# Altium project Freezer_Controller.PrjPcb (part 1 of 2)
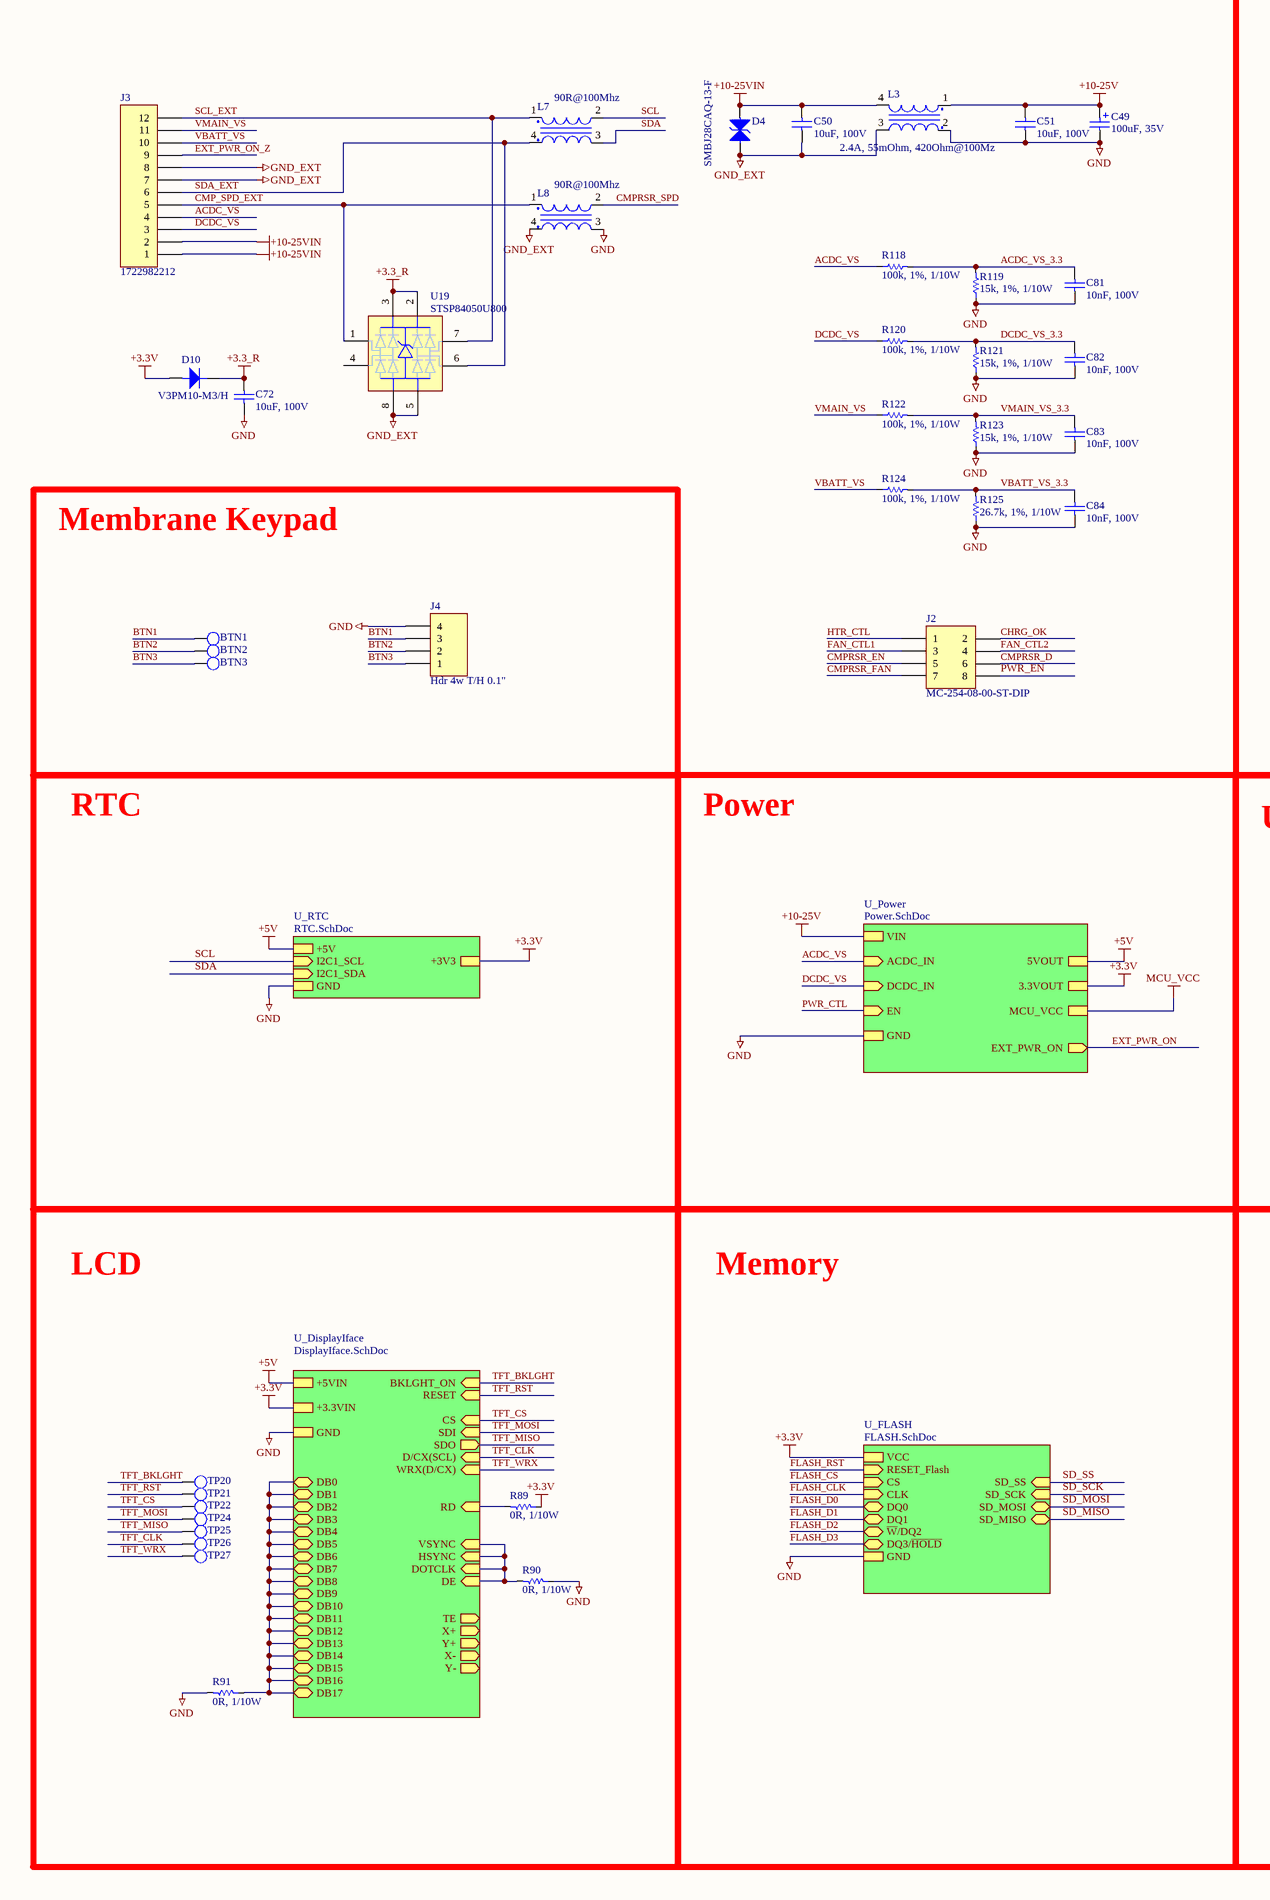
[diagram p0: TopLevel.SchDoc, left]
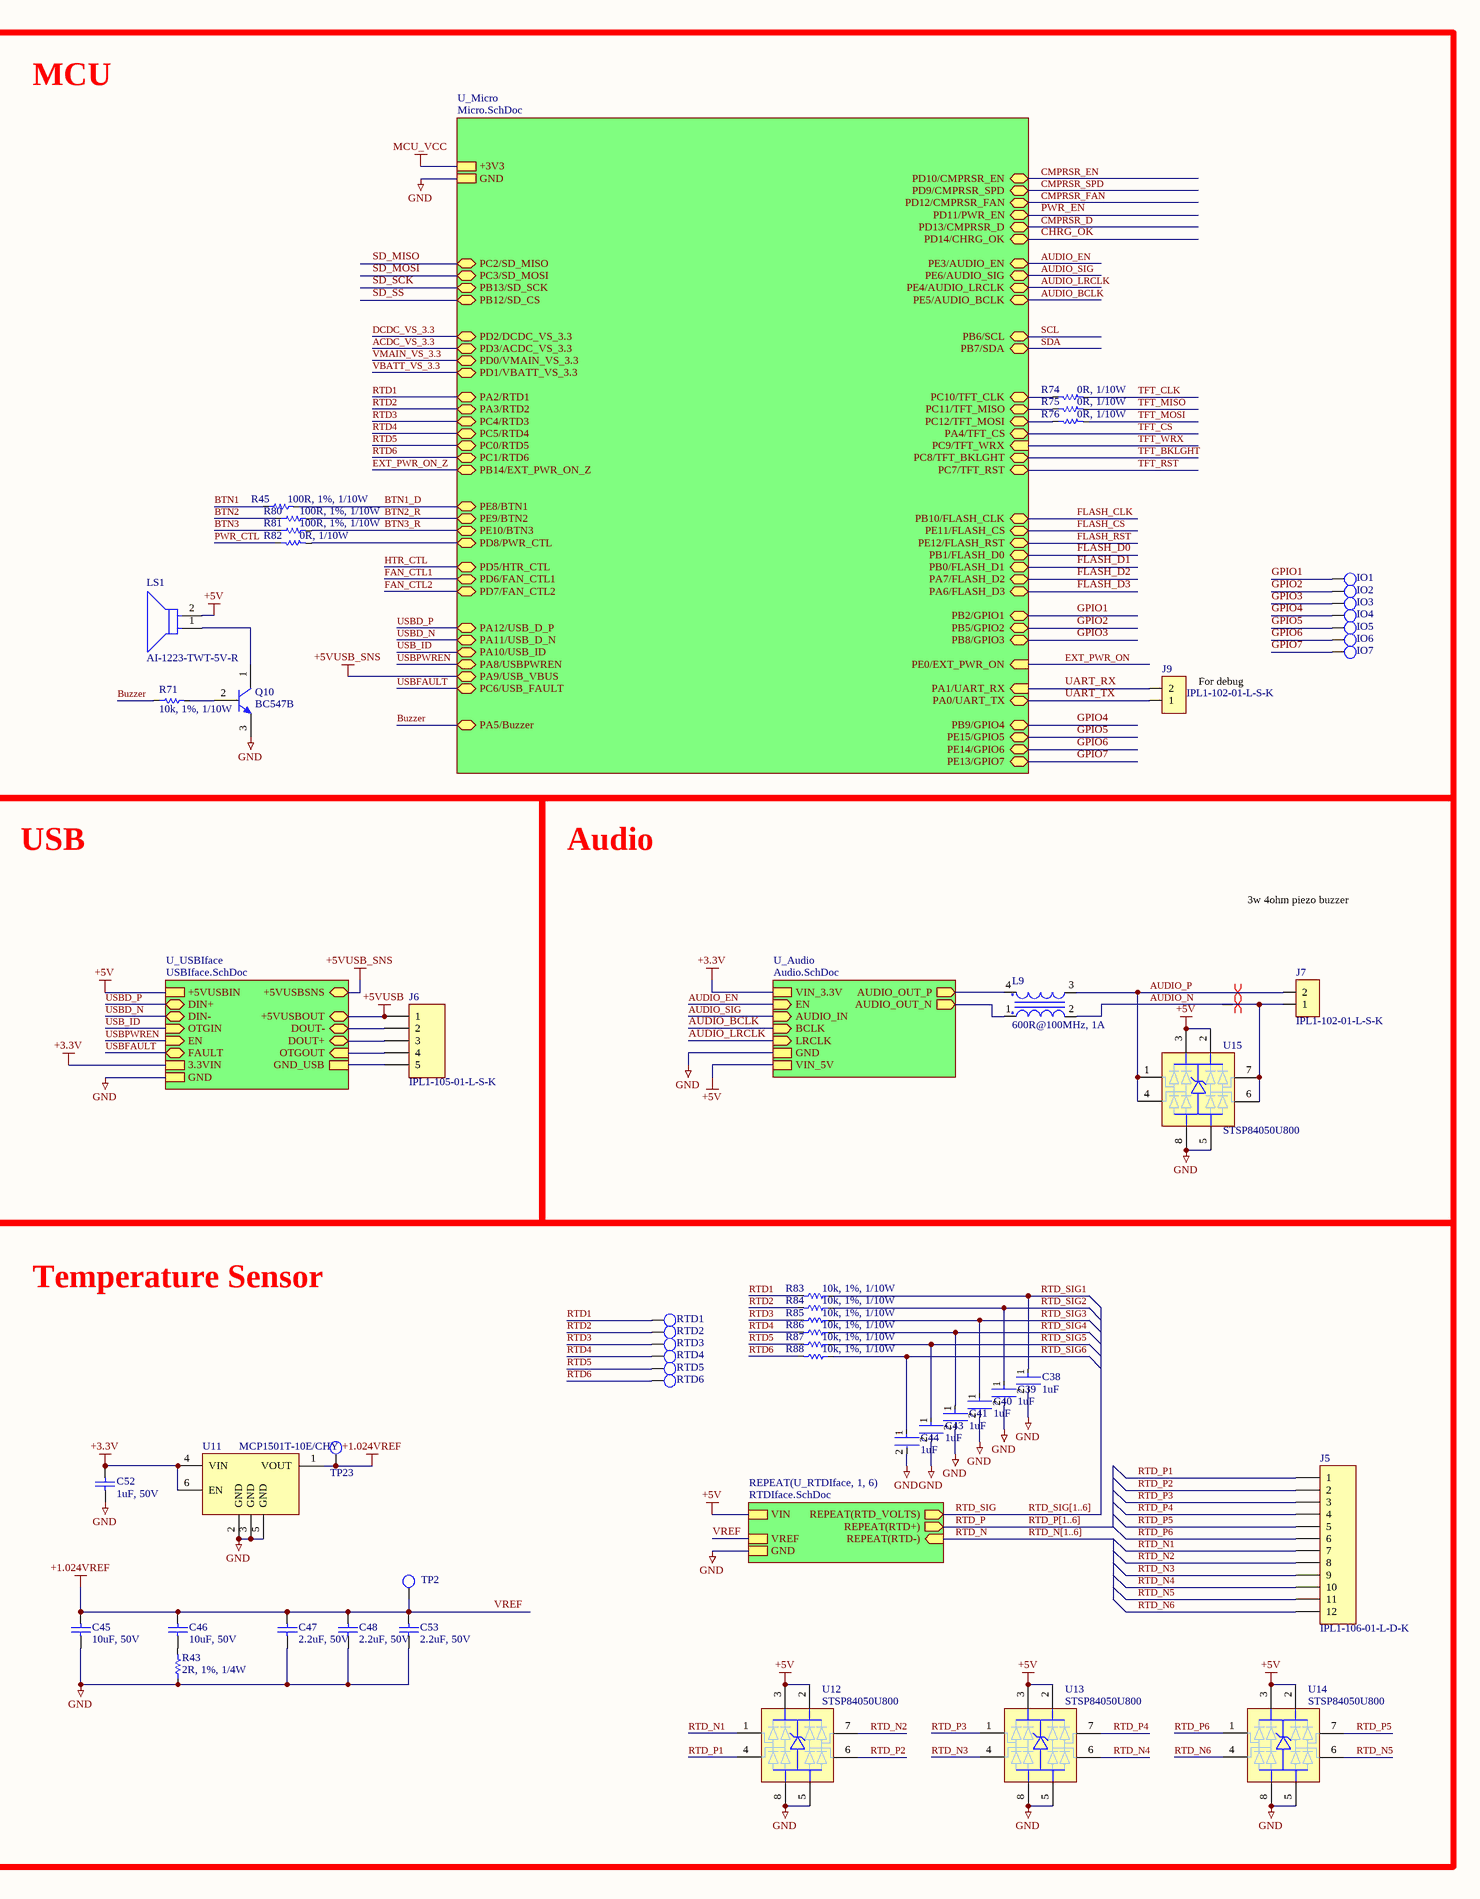
[diagram p1: TopLevel.SchDoc, right]
BOMRevision: 1.0; ProjectNumber: BIOL-003; ProjectRevision: 1.0; ProjectTitle: Freezer_Controller
9 sheets, 351 parts. Net scope: hierarchical (ports join the sheet entries above them; power ports are global).
Board file: Freezer_Controller.PcbDoc
Sheets:
  TopLevel.SchDoc
    U_Micro = Micro.SchDoc
    U_Power = Power.SchDoc
    U_RTDIface1 = RTDIface.SchDoc
    U_RTDIface2 = RTDIface.SchDoc
    U_RTDIface3 = RTDIface.SchDoc
    U_RTDIface4 = RTDIface.SchDoc
    U_RTDIface5 = RTDIface.SchDoc
    U_RTDIface6 = RTDIface.SchDoc
    U_DisplayIface = DisplayIface.SchDoc
    U_USBIface = USBIface.SchDoc
    U_Audio = Audio.SchDoc
    U_FLASH = FLASH.SchDoc
    U_RTC = RTC.SchDoc

## Sheet TopLevel.SchDoc
size A2; SheetNumber: 1; SheetTotal: 9

### Parts
BTN1  2mm  [TEST POINT 40 Mil]  (value not drawn)  (no BOM)
BTN2  2mm  [TEST POINT 40 Mil]  (value not drawn)  (no BOM)
BTN3  2mm  [TEST POINT 40 Mil]  (value not drawn)  (no BOM)
C38  1uF  [FP-CL10B105KO8NNNC-MFG]
C39  1uF  [FP-CL10B105KO8NNNC-MFG]
C40  1uF  [FP-CL10B105KO8NNNC-MFG]
C41  1uF  [FP-CL10B105KO8NNNC-MFG]
C43  1uF  [FP-CL10B105KO8NNNC-MFG]
C44  1uF  [FP-CL10B105KO8NNNC-MFG]
C45  10uF, 50V  [1206]
C46  10uF, 50V  [1206]
C47  2.2uF, 50V  [1206]
C48  2.2uF, 50V  [1206]
C49  100uF, 35V  [CAPAE7866X80L]
C50  10uF, 100V  [1210]
C51  10uF, 100V  [1210]
C52  1uF, 50V  [0805]
C53  2.2uF, 50V  [1206]
C72  10uF, 100V  [1210]
C81  10nF, 100V  [0603]
C82  10nF, 100V  [0603]
C83  10nF, 100V  [0603]
C84  10nF, 100V  [0603]
D4  SMBJ28CAQ-13-F  [SMB]
D10  V3PM10-M3/H  [SMP]
IO1  2mm  [TEST POINT 40 Mil]  (value not drawn)  (no BOM)
IO2  2mm  [TEST POINT 40 Mil]  (value not drawn)  (no BOM)
IO3  2mm  [TEST POINT 40 Mil]  (value not drawn)  (no BOM)
IO4  2mm  [TEST POINT 40 Mil]  (value not drawn)  (no BOM)
IO5  2mm  [TEST POINT 40 Mil]  (value not drawn)  (no BOM)
IO6  2mm  [TEST POINT 40 Mil]  (value not drawn)  (no BOM)
IO7  2mm  [TEST POINT 40 Mil]  (value not drawn)  (no BOM)
J2  MC-254-08-00-ST-DIP  [CONN_206832-0823]
J3  1722982212  [CONN_MOLEX_1722982212]
J4  Hdr 4w T/H 0.1"  [CONN_HDR_FRICTION_LOCK_2.54MM_4]
J5  IPL1-106-01-L-D-K  [CONN_SAMTEC_IPL1-106-XX-X-D]
J6  IPL1-105-01-L-S-K  [CONN_SAMTEC_IPL1-105-XX-X-S]
J7  IPL1-102-01-L-S-K  [CONN_SAMTEC_IPL1-102-XX-X-S]
J9  IPL1-102-01-L-S-K  [CONN_SAMTEC_IPL1-102-XX-X-S]
L3  2.4A, 55mOhm, 420Ohm@100Mz  [CHOKE_SMD_4.7X4.5]
L7  90R@100Mhz  [BOURNS_SRF2012]
L8  90R@100Mhz  [BOURNS_SRF2012]
L9  600R@100MHz, 1A  [DFN260P320X200-4L]
LS1  AI-1223-TWT-5V-R  [FP-AI-1223-TWT-5V-R-MFG]
Q10  BC547B  [ONSC-TO-92-3-29-11]
R43  2R, 1%, 1/4W  [1206]
R45  100R, 1%, 1/10W  [0603]
R71  10k, 1%, 1/10W  [0603]
R74  0R, 1/10W  [0603]
R75  0R, 1/10W  [0603]
R76  0R, 1/10W  [0603]
R80  100R, 1%, 1/10W  [0603]
R81  100R, 1%, 1/10W  [0603]
R82  0R, 1/10W  [0603]
R83  10k, 1%, 1/10W  [0603]
R84  10k, 1%, 1/10W  [0603]
R85  10k, 1%, 1/10W  [0603]
R86  10k, 1%, 1/10W  [0603]
R87  10k, 1%, 1/10W  [0603]
R88  10k, 1%, 1/10W  [0603]
R89  0R, 1/10W  [0603]
R90  0R, 1/10W  [0603]
R91  0R, 1/10W  [0603]
R118  100k, 1%, 1/10W  [0603]
R119  15k, 1%, 1/10W  [0603]
R120  100k, 1%, 1/10W  [0603]
R121  15k, 1%, 1/10W  [0603]
R122  100k, 1%, 1/10W  [0603]
R123  15k, 1%, 1/10W  [0603]
R124  100k, 1%, 1/10W  [0603]
R125  26.7k, 1%, 1/10W  [0603]
RTD1  2mm  [TEST POINT 40 Mil]  (value not drawn)  (no BOM)
RTD2  2mm  [TEST POINT 40 Mil]  (value not drawn)  (no BOM)
RTD3  2mm  [TEST POINT 40 Mil]  (value not drawn)  (no BOM)
RTD4  2mm  [TEST POINT 40 Mil]  (value not drawn)  (no BOM)
RTD5  2mm  [TEST POINT 40 Mil]  (value not drawn)  (no BOM)
RTD6  2mm  [TEST POINT 40 Mil]  (value not drawn)  (no BOM)
TP2  2mm  [TEST POINT 40 Mil]  (value not drawn)  (no BOM)
TP20  2mm  [TEST POINT 40 Mil]  (value not drawn)  (no BOM)
TP21  2mm  [TEST POINT 40 Mil]  (value not drawn)  (no BOM)
TP22  2mm  [TEST POINT 40 Mil]  (value not drawn)  (no BOM)
TP23  2mm  [TEST POINT 40 Mil]  (value not drawn)  (no BOM)
TP24  2mm  [TEST POINT 40 Mil]  (value not drawn)  (no BOM)
TP25  2mm  [TEST POINT 40 Mil]  (value not drawn)  (no BOM)
TP26  2mm  [TEST POINT 40 Mil]  (value not drawn)  (no BOM)
TP27  2mm  [TEST POINT 40 Mil]  (value not drawn)  (no BOM)
U11  MCP1501T-10E/CHY  [SOT23-6]
U12  STSP84050U800  [SOIC127P600X163-8N]
U13  STSP84050U800  [SOIC127P600X163-8N]
U14  STSP84050U800  [SOIC127P600X163-8N]
U15  STSP84050U800  [SOIC127P600X163-8N]
U19  STSP84050U800  [SOIC127P600X163-8N]

### Blocks framed on the sheet
MCU: IO1-IO7 J9 LS1 Q10 R45 R71 R74-R76 R80-R82
Membrane Keypad: BTN1-BTN3 J4
USB: J6
Audio: J7 L9 U15
LCD: R89-R91 TP20-TP22 TP24-TP27
Temperature Sensor: C38-C41 C43-C48 C52 C53 J5 R43 R83-R88 RTD1-RTD6 TP2 TP23 U11-U14

### Sub-sheets
REPEAT(U_RTDIface, 1, 6) = RTDIface.SchDoc: REPEAT(RTD_VOLTS) (out), GND, VIN, REPEAT(RTD+) (out), REPEAT(RTD-) (in), VREF
U_Audio = Audio.SchDoc: AUDIO_IN (in), EN (in), AUDIO_OUT_P (out), AUDIO_OUT_N (out), VIN_3.3V, BCLK (in), LRCLK (in), GND, VIN_5V
U_DisplayIface = DisplayIface.SchDoc: DB0 (bidir), DB1 (bidir), DB2 (bidir), DB3 (bidir), DB4 (bidir), DB5 (bidir), DB6 (bidir), DB7 (bidir), DB8 (bidir), DB9 (bidir), DB10 (bidir), DB11 (bidir), DB12 (bidir), DB13 (bidir), DB14 (bidir), DB15 (bidir), DB16 (bidir), DB17 (bidir), RD (in), +5VIN, +3.3VIN, GND, SDO (out), RESET (in), SDI (in), WRX(D/CX) (in), D/CX(SCL) (in), CS (in), BKLGHT_ON (in), TE (out), X+ (out), Y+ (out), X- (out), Y- (out), VSYNC (in), HSYNC (in), DOTCLK (in), DE (in)
U_FLASH = FLASH.SchDoc: VCC, RESET_Flash (in), CS (in), CLK (in), DQ0 (bidir), DQ1 (bidir), ~{W}/DQ2 (bidir), GND, DQ3/~{HOLD} (bidir), SD_SS (in), SD_SCK (in), SD_MOSI (bidir), SD_MISO (bidir)
U_Micro = Micro.SchDoc: PA10/USB_ID (bidir), PB10/FLASH_CLK (bidir), +3V3, GND, PE6/AUDIO_SIG (bidir), PA8/USBPWREN (bidir), PD13/CMPRSR_D (bidir), PB7/SDA (bidir), PA3/RTD2 (bidir), PD7/FAN_CTL2 (bidir), PC1/RTD6 (bidir), PC2/SD_MISO (bidir), PA11/USB_D_N (bidir), PA12/USB_D_P (bidir), PC3/SD_MOSI (bidir), PE12/FLASH_RST (bidir), PC8/TFT_BKLGHT (bidir), PC7/TFT_RST (bidir), PE11/FLASH_CS (bidir), PD10/CMPRSR_EN (bidir), PC9/TFT_WRX (in), PC10/TFT_CLK (bidir), PC11/TFT_MISO (bidir), PC12/TFT_MOSI (bidir), PA4/TFT_CS (bidir), PD9/CMPRSR_SPD (bidir), PB13/SD_SCK (bidir), PB12/SD_CS (bidir), PB6/SCL (bidir), PD6/FAN_CTL1 (bidir), PD14/CHRG_OK (bidir), PB14/EXT_PWR_ON_Z (bidir), PC4/RTD3 (bidir), PC5/RTD4 (bidir), PC0/RTD5 (bidir), PD8/PWR_CTL (bidir), PD5/HTR_CTL (bidir), PE8/BTN1 (bidir), PD0/VMAIN_VS_3.3 (bidir), PD1/VBATT_VS_3.3 (bidir), PD3/ACDC_VS_3.3 (bidir), PD2/DCDC_VS_3.3 (bidir), PE3/AUDIO_EN (bidir), PA2/RTD1 (bidir), PE9/BTN2 (bidir), PE10/BTN3 (bidir), PD12/CMPRSR_FAN (bidir), PE0/EXT_PWR_ON (in), PA5/Buzzer (bidir), PB1/FLASH_D0 (bidir), PB0/FLASH_D1 (bidir), PA7/FLASH_D2 (bidir), PA6/FLASH_D3 (bidir), PA9/USB_VBUS (bidir), PC6/USB_FAULT (bidir), PE4/AUDIO_LRCLK (bidir), PE5/AUDIO_BCLK (bidir), PA1/UART_RX (in), PA0/UART_TX (bidir), PB2/GPIO1 (bidir), PB8/GPIO3 (bidir), PB5/GPIO2 (bidir), PB9/GPIO4 (bidir), PE15/GPIO5 (bidir), PE14/GPIO6 (bidir), PE13/GPIO7 (bidir), PD11/PWR_EN (bidir)
U_Power = Power.SchDoc: EN (in), VIN, ACDC_IN (in), GND, DCDC_IN (in), 5VOUT, 3.3VOUT, EXT_PWR_ON (out), MCU_VCC
U_RTC = RTC.SchDoc: I2C1_SCL (in), +5V, GND, +3V3, I2C1_SDA (in)
U_USBIface = USBIface.SchDoc: +5VUSBIN, DIN+ (bidir), DIN- (bidir), OTGIN (in), GND, EN (in), FAULT (bidir), +5VUSBOUT (bidir), DOUT+ (bidir), DOUT- (bidir), OTGOUT (in), +5VUSBSNS (bidir), GND_USB, 3.3VIN

### Nets
+3.3_R: C72.2 D10.2(K) U19.2 U19.3
+3.3V: C52.2 D10.1(A) R89.1 U11.4(VIN) U11.6(EN) ; sheet U_Micro/+3V3, sheet U_Power/3.3VOUT, sheet U_Power/MCU_VCC, sheet U_DisplayIface/+3.3VIN, sheet U_USBIface/3.3VIN, sheet U_Audio/VIN_3.3V, sheet U_FLASH/VCC, sheet U_RTC/+3V3  [also labelled MCU_VCC]
+5V: LS1.2(A) U12.2 U12.3 U13.2 U13.3 U14.2 U14.3 U15.2 U15.3 ; sheet U_Power/5VOUT, sheet REPEAT(U_RTDIface, 1, 6)/VIN, sheet U_DisplayIface/+5VIN, sheet U_USBIface/+5VUSBIN, sheet U_Audio/VIN_5V, sheet U_RTC/+5V
+5VUSB: J6.1 ; sheet U_Micro/PA9/USB_VBUS, sheet U_USBIface/+5VUSBOUT, sheet U_USBIface/+5VUSBSNS  [also labelled +5VUSB_SNS]  [project net USB_VBUS]
+10-25V: C49.1 C51.2 L3.1 ; sheet U_Power/VIN
+10-25VIN: C50.2 D4.2(K) J3.1 J3.2 L3.4
ACDC_VS: J3.4 R118.1 ; sheet U_Power/ACDC_IN
DCDC_VS: J3.3 R120.1 ; sheet U_Power/DCDC_IN
GND: C38.2 C39.2 C40.2 C41.2 C43.2 C44.2 C45.1 C47.1 C48.1 C49.2 C51.1 C52.1 C53.1 C72.1 C81.1 C82.1 C83.1 C84.1 J4.4 J6.5 L3.2 L8.3 Q10.3(E) R43.1 R90.1 R91.2 R119.1 R121.1 R123.1 R125.1 U11.2(GND) U11.3(GND) U11.5(GND) U12.5 U12.8 U13.5 U13.8 U14.5 U14.8 U15.5 U15.8 ; sheet U_Micro/GND, sheet U_Power/GND, sheet REPEAT(U_RTDIface, 1, 6)/GND, sheet U_DisplayIface/GND, sheet U_USBIface/GND, sheet U_USBIface/GND_USB, sheet U_Audio/GND, sheet U_FLASH/GND, sheet U_RTC/GND
GND_EXT: C50.1 D4.1(A) J3.7 J3.8 L3.3 L8.4 U19.5 U19.8
VREF: C45.2 C46.2 C47.2 C48.2 C53.2 TP2.1(TP) TP23.1(TP) U11.1(VOUT) ; sheet REPEAT(U_RTDIface, 1, 6)/VREF  [also labelled +1.024VREF]
ACDC_VS_3.3: C81.2 R118.2 R119.2 ; sheet U_Micro/PD3/ACDC_VS_3.3
AUDIO_BCLK: sheet U_Micro/PE5/AUDIO_BCLK, sheet U_Audio/BCLK
AUDIO_EN: sheet U_Micro/PE3/AUDIO_EN, sheet U_Audio/EN
AUDIO_LRCLK: sheet U_Micro/PE4/AUDIO_LRCLK, sheet U_Audio/LRCLK
AUDIO_N: J7.1 L9.2 U15.6 U15.7
AUDIO_P: J7.2 L9.3 U15.1 U15.4
AUDIO_SIG: sheet U_Micro/PE6/AUDIO_SIG, sheet U_Audio/AUDIO_IN  [project net AUDIO_IN]
BTN1: BTN1.1(TP) J4.3 R45.1
BTN1_D: R45.2 ; sheet U_Micro/PE8/BTN1
BTN2: BTN2.1(TP) J4.2 R80.1
BTN2_R: R80.2 ; sheet U_Micro/PE9/BTN2
BTN3: BTN3.1(TP) J4.1 R81.1
BTN3_R: R81.2 ; sheet U_Micro/PE10/BTN3
Buzzer: R71.1 ; sheet U_Micro/PA5/Buzzer
CHRG_OK: J2.2 ; sheet U_Micro/PD14/CHRG_OK
CMP_SPD_EXT: J3.5 L8.1 U19.1
CMPRSR_D: J2.6 ; sheet U_Micro/PD13/CMPRSR_D
CMPRSR_EN: J2.5 ; sheet U_Micro/PD10/CMPRSR_EN
CMPRSR_FAN: J2.7 ; sheet U_Micro/PD12/CMPRSR_FAN
CMPRSR_SPD: L8.2 ; sheet U_Micro/PD9/CMPRSR_SPD
DB0: R91.1 ; sheet U_DisplayIface/DB0, sheet U_DisplayIface/DB1, sheet U_DisplayIface/DB2, sheet U_DisplayIface/DB3, sheet U_DisplayIface/DB4, sheet U_DisplayIface/DB5, sheet U_DisplayIface/DB6, sheet U_DisplayIface/DB7, sheet U_DisplayIface/DB8, sheet U_DisplayIface/DB9, sheet U_DisplayIface/DB10, sheet U_DisplayIface/DB11, sheet U_DisplayIface/DB12, sheet U_DisplayIface/DB13, sheet U_DisplayIface/DB14, sheet U_DisplayIface/DB15, sheet U_DisplayIface/DB16, sheet U_DisplayIface/DB17
DCDC_VS_3.3: C82.2 R120.2 R121.2 ; sheet U_Micro/PD2/DCDC_VS_3.3
DE: R90.2 ; sheet U_DisplayIface/VSYNC, sheet U_DisplayIface/HSYNC, sheet U_DisplayIface/DOTCLK, sheet U_DisplayIface/DE
DOUT_N: J6.2 ; sheet U_USBIface/DOUT-
DOUT_P: J6.3 ; sheet U_USBIface/DOUT+
EXT_PWR_ON: sheet U_Micro/PE0/EXT_PWR_ON, sheet U_Power/EXT_PWR_ON
EXT_PWR_ON_Z: J3.9 ; sheet U_Micro/PB14/EXT_PWR_ON_Z
FAN_CTL1: J2.3 ; sheet U_Micro/PD6/FAN_CTL1
FAN_CTL2: J2.4 ; sheet U_Micro/PD7/FAN_CTL2
FLASH_CLK: sheet U_Micro/PB10/FLASH_CLK, sheet U_FLASH/CLK  [project net CLK]
FLASH_CS: sheet U_Micro/PE11/FLASH_CS, sheet U_FLASH/CS  [project net CS]
FLASH_D0: sheet U_Micro/PB1/FLASH_D0, sheet U_FLASH/DQ0  [project net DQ0]
FLASH_D1: sheet U_Micro/PB0/FLASH_D1, sheet U_FLASH/DQ1  [project net DQ1]
FLASH_D2: sheet U_Micro/PA7/FLASH_D2, sheet U_FLASH/~{W}/DQ2
FLASH_D3: sheet U_Micro/PA6/FLASH_D3, sheet U_FLASH/DQ3/~{HOLD}  [project net DQ3/~{HOLD}]
FLASH_RST: sheet U_Micro/PE12/FLASH_RST, sheet U_FLASH/RESET_Flash  [project net ~{FLASH_RST}]
GPIO1: IO1.1(TP) ; sheet U_Micro/PB2/GPIO1
GPIO2: IO2.1(TP) ; sheet U_Micro/PB5/GPIO2
GPIO3: IO3.1(TP) ; sheet U_Micro/PB8/GPIO3
GPIO4: IO4.1(TP) ; sheet U_Micro/PB9/GPIO4
GPIO5: IO5.1(TP) ; sheet U_Micro/PE15/GPIO5
GPIO6: IO6.1(TP) ; sheet U_Micro/PE14/GPIO6
GPIO7: IO7.1(TP) ; sheet U_Micro/PE13/GPIO7
HTR_CTL: J2.1 ; sheet U_Micro/PD5/HTR_CTL
O_N: L9.1 ; sheet U_Audio/AUDIO_OUT_N
O_P: L9.4 ; sheet U_Audio/AUDIO_OUT_P
OTGOUT: J6.4 ; sheet U_USBIface/OTGOUT
PWR_CTL: R82.1 ; sheet U_Power/EN  [project net EN]
PWR_CTL1: R82.2 ; sheet U_Micro/PD8/PWR_CTL
PWR_EN: J2.8 ; sheet U_Micro/PD11/PWR_EN
RD: R89.2 ; sheet U_DisplayIface/RD
RTD1: R83.2 RTD1.1(TP) ; sheet U_Micro/PA2/RTD1
RTD2: R84.2 RTD2.1(TP) ; sheet U_Micro/PA3/RTD2
RTD3: R85.2 RTD3.1(TP) ; sheet U_Micro/PC4/RTD3
RTD4: R86.2 RTD4.1(TP) ; sheet U_Micro/PC5/RTD4
RTD5: R87.2 RTD5.1(TP) ; sheet U_Micro/PC0/RTD5
RTD6: R88.2 RTD6.1(TP) ; sheet U_Micro/PC1/RTD6
RTD_N: sheet REPEAT(U_RTDIface, 1, 6)/REPEAT(RTD-)
RTD_N1: J5.7 U12.1  [project net I_RTD]
RTD_N2: J5.8 U12.7  [project net I_RTD]
RTD_N3: J5.9 U13.4  [project net I_RTD]
RTD_N4: J5.10 U13.6  [project net I_RTD]
RTD_N5: J5.11 U14.6  [project net I_RTD]
RTD_N6: J5.12 U14.4  [project net I_RTD]
RTD_P: sheet REPEAT(U_RTDIface, 1, 6)/REPEAT(RTD+)
RTD_P1: J5.1 U12.4  [project net READ]
RTD_P2: J5.2 U12.6  [project net READ]
RTD_P3: J5.3 U13.1  [project net READ]
RTD_P4: J5.4 U13.7  [project net READ]
RTD_P5: J5.5 U14.7  [project net READ]
RTD_P6: J5.6 U14.1  [project net READ]
RTD_SIG: sheet REPEAT(U_RTDIface, 1, 6)/REPEAT(RTD_VOLTS)
RTD_SIG1: C38.1 R83.1  [project net AMPREAD]
RTD_SIG2: C39.1 R84.1  [project net AMPREAD]
RTD_SIG3: C40.1 R85.1  [project net AMPREAD]
RTD_SIG4: C41.1 R86.1  [project net AMPREAD]
RTD_SIG5: C43.1 R87.1  [project net AMPREAD]
RTD_SIG6: C44.1 R88.1  [project net AMPREAD]
SCL: L7.2 ; sheet U_Micro/PB6/SCL, sheet U_RTC/I2C1_SCL  [project net I2C1_SCL]
SCL_EXT: J3.12 L7.1 U19.7
SD_MISO: sheet U_Micro/PC2/SD_MISO, sheet U_FLASH/SD_MISO
SD_MOSI: sheet U_Micro/PC3/SD_MOSI, sheet U_FLASH/SD_MOSI
SD_SCK: sheet U_Micro/PB13/SD_SCK, sheet U_FLASH/SD_SCK
SD_SS: sheet U_Micro/PB12/SD_CS, sheet U_FLASH/SD_SS
SDA: L7.3 ; sheet U_Micro/PB7/SDA, sheet U_RTC/I2C1_SDA  [project net I2C1_SDA]
SDA_EXT: J3.6 L7.4 U19.6
TFT_BKLGHT: TP20.1(TP) ; sheet U_Micro/PC8/TFT_BKLGHT, sheet U_DisplayIface/BKLGHT_ON  [project net BKLGHT_ON]
TFT_CLK: R74.2 TP26.1(TP) ; sheet U_DisplayIface/D/CX(SCL)  [project net D/CX(SCL)]
TFT_CLK: R74.1 ; sheet U_Micro/PC10/TFT_CLK  [a separate net that carries the same name]
TFT_CS: TP22.1(TP) ; sheet U_Micro/PA4/TFT_CS, sheet U_DisplayIface/CS  [project net DISPL_CS]
TFT_MISO: R75.2 TP25.1(TP) ; sheet U_DisplayIface/SDO  [project net SDO]
TFT_MISO: R75.1 ; sheet U_Micro/PC11/TFT_MISO  [a separate net that carries the same name]
TFT_MOSI: R76.2 TP24.1(TP) ; sheet U_DisplayIface/SDI  [project net SDI]
TFT_MOSI: R76.1 ; sheet U_Micro/PC12/TFT_MOSI  [a separate net that carries the same name]
TFT_RST: TP21.1(TP) ; sheet U_Micro/PC7/TFT_RST, sheet U_DisplayIface/RESET  [project net RESET]
TFT_WRX: TP27.1(TP) ; sheet U_Micro/PC9/TFT_WRX, sheet U_DisplayIface/WRX(D/CX)
UART_RX: J9.2 ; sheet U_Micro/PA1/UART_RX
UART_TX: J9.1 ; sheet U_Micro/PA0/UART_TX
USB_ID: sheet U_Micro/PA10/USB_ID, sheet U_USBIface/OTGIN
USBD_N: sheet U_Micro/PA11/USB_D_N, sheet U_USBIface/DIN-  [project net USB_D_N]
USBD_P: sheet U_Micro/PA12/USB_D_P, sheet U_USBIface/DIN+  [project net USB_D_P]
USBFAULT: sheet U_Micro/PC6/USB_FAULT, sheet U_USBIface/FAULT  [project net OTG_FLT]
USBPWREN: sheet U_Micro/PA8/USBPWREN, sheet U_USBIface/EN  [project net OTG_PWR_EN]
VBATT_VS: J3.10 R124.1
VBATT_VS_3.3: C84.2 R124.2 R125.2 ; sheet U_Micro/PD1/VBATT_VS_3.3
VMAIN_VS: J3.11 R122.1
VMAIN_VS_3.3: C83.2 R122.2 R123.2 ; sheet U_Micro/PD0/VMAIN_VS_3.3
NetC46_1: C46.1 R43.2
NetLS1_1: LS1.1(C) Q10.1(C)
NetQ10_2: Q10.2(B) R71.2

Not connected (* = marked no-connect by the designer): U19 4

### Buses and harness runs
bus RTD_N[1..6]
bus RTD_P[1..6]
bus RTD_SIG[1..6]

### Layout directives
differential pair: AUDIO_N, AUDIO_P

### Notes on the sheet
- For debug
- RTC
- Power
- 3w 4ohm piezo buzzer
- Memory

### Library data of the parts
BTN1-BTN3 IO1-IO7 RTD1-RTD6 TP2 TP20-TP27 = NS00254: Testpoint 2mm round; Part Number: NS00254; Type: Mechanical; Value: 2mm
C38-C41 C43 C44 = CMP-2000-06093-2: CAP CER 1UF 16V X7R 0603; Manufacturer: Samsung Electro-Mechanics America, Inc; Manufacturer Part Number: CL10B105KO8NNNC; Temperature Coefficient: 15%; Material: Ceramic; Tolerance: 10%; Voltage Rating: 16V; Automotive: No; ComponentLink2Description: Datasheet; Device Class L3: Ceramic Capacitors; Capacitance: 1uF; Temperature Characteristic: X7R; Temperature Range High: +125°C; Digikey Description: CAP CER 1UF 16V X7R 0603; Device Class L2: Capacitors; Octopart: https://octopart.com/cl10b105ko8nnnc-samsung-19018973; ComponentLink2URL: http://www.samsungsem.com/global/front/downloadcms.do?path=%2F%2Fglobal%2F%2Fsupport%2F%2Fproduct-search%2F%2Fmlcc%2F%2F__icsFiles%2F%2Fafieldfile%2F%2F2019%2F%2F06%2F%2F18&fileName=CL10B105KO8NNNC-19.pdf; Lead Free: Yes; Height: 0.9mm; Package: CL10B105KO8NNNC; Temperature Range Low: -55°C; Value: 1uF; Device Class L1: Passive Components; RoHS: TRUE; Temperature: -55°C to +125°C; Category: Cap; Ipc Land Pattern Name: CAPC16080X80; Supplier 1: Digikey; Supplier Part Number: 1276-1019-2-ND
C45 C46 = NS00832: CAP CER 10UF 50V X7R 1206; Type: C; Alternatives: Generic; Part Number: NS00832; Value: 10uF, 50V; Supplier 1: Digi-Key; Supplier Part Number 1: 1276-6767-1-ND
C47 C48 C53 = NS00824: CAP CER 2.2UF 50V X7R 1206; Type: C; Alternatives: Generic; Part Number: NS00824; Value: 2.2uF, 50V; Supplier 1: Digi-Key; Supplier Part Number 1: 1276-3137-1-ND
C49 = NS00911: CAP ALUM 100UF 20% 35V SMD; Type: C; Alternatives: Generic; Part Number: NS00911; Value: 100uF, 35V; Supplier 1: Digi-Key; Supplier Part Number 1: PCE5051CT-ND
C50 C51 C72 = NS00779: MLCC 10UF 100V X7S 1210; Type: C; Alternatives: Generic; Part Number: NS00779; Value: 10uF, 100V; Supplier 1: Digi-Key; Supplier Part Number 1: 1276-CL32Y106KCVZNWECT-ND
C52 = NS00871: CAP CER 1UF 50V X7R 0805; Type: C; Alternatives: Generic; Part Number: NS00871; Value: 1uF, 50V; Supplier 1: Digi-Key; Supplier Part Number 1: 1276-6470-1-ND
C81-C84 = NS00848: CAP CER 10000PF 100V C0G 0603; Type: C; Alternatives: Generic; Part Number: NS00848; Value: 10nF, 100V; Supplier 1: Digi-Key; Supplier Part Number 1: 445-172665-1-ND
D4 = NS00890: TVS DIODE 28VWM 45.4VC SMB; Part Number: NS00890; Type: Diode; Value: SMBJ28CAQ-13-F; ComponentLink1Description: Datasheet; ComponentLink1URL: H:\Doc\Diodes\SMBJ6.5CAQ-SMBJ100CAQ.pdf; Supplier 1: Digi-Key; Supplier Part Number 1: SMBJ28CAQ-13-FDICT-ND
D10 = NS00857: SCHOTTKY RECTIFIER 3A 100V SMP; Part Number: NS00857; Type: Diode; Value: V3PM10-M3/H; ComponentLink1Description: Datasheet; ComponentLink1URL: H:\Doc\Vishay\v3pm10.pdf; Supplier 1: Digi-Key; Supplier Part Number 1: 112-V3PM10-M3/HCT-ND
J2 = Header 4X2: Header, 4-Pin, Dual row; LatestRevisionDate: 17-Jul-2002; LatestRevisionNote: Re-released for DXP Platform.; Publisher: Altium Limited; Supplier 1: Farnell; Supplier Part Number 1: MC-254-08-00-ST-DIP
J3 = NS00894: CONN HEADER VERT 12POS 3.5MM; Part Number: NS00894; Type: Connector; Value: 1722982212; ComponentLink1Description: Datasheet; ComponentLink1URL: H:\Doc\Molex\1722982212_PCB_HEADERS.pdf; ComponentLink2Description: Application Specification; ComponentLink2URL: H:\Doc\Molex\AS-172323-0001-001.pdf; ComponentLink3Description: Drawing; ComponentLink3URL: H:\Doc\Molex\1722982212_sd.pdf; Supplier 1: Digi-Key; Supplier Part Number 1: WM11767-ND
J4 = NS00337: 4 Positions Header, Unshrouded Connector 0.100" (2.54mm) Through Hole Gold; Alternatives: Generic; Part Number: NS00337; Type: Connector; Value: Hdr 4w T/H 0.1"; ComponentLink1Description: Datasheet; ComponentLink1URL: H:\Doc\Molex\PS-10-07.pdf; ComponentLink2Description: Drawing; ComponentLink2URL: H:\Doc\Molex\022112022_sd.pdf; Supplier 1: Digi-Key; Supplier Part Number 1: WM2702-ND
J5 = NS00892: CONN HEADER VERT 12POS 2.54MM; Part Number: NS00892; Type: Connector; Value: IPL1-106-01-L-D-K; ComponentLink1Description: Datasheet; ComponentLink1URL: H:\Doc\Samtec\100_mini_mate.pdf; ComponentLink2Description: Dimensions; ComponentLink2URL: H:\Doc\Samtec\ipl1.pdf; Supplier 1: Digi-Key; Supplier Part Number 1: SAM8941-ND
J6 = NS00898: CONN HEADER VERT 5POS 2.54MM; Part Number: NS00898; Type: Connector; Value: IPL1-105-01-L-S-K; ComponentLink1Description: Datasheet; ComponentLink1URL: H:\Doc\Samtec\100_mini_mate.pdf; ComponentLink2Description: Dimensions; ComponentLink2URL: H:\Doc\Samtec\ipl1.pdf; Supplier 1: Digi-Key; Supplier Part Number 1: SAM10577-ND
J7 J9 = NS00896: CONN HEADER VERT 2POS 2.54MM; Part Number: NS00896; Type: Connector; Value: IPL1-102-01-L-S-K; ComponentLink1Description: Datasheet; ComponentLink1URL: H:\Doc\Samtec\100_mini_mate.pdf; ComponentLink2Description: Dimensions; ComponentLink2URL: H:\Doc\Samtec\ipl1.pdf; Supplier 1: Digi-Key; Supplier Part Number 1: SAM8824-ND
L3 = NS00257: CHOKE COMMON MODE 420 OHM SMD; Type: Inductor; Part Number: NS00257; Value: 2.4A, 55mOhm, 420Ohm@100Mz; ComponentLink1Description: Datasheet; ComponentLink1URL: H:\Doc\TDK\cmf_commercial_power_acm4520_en.pdf; Supplier 1: Digi-Key; Supplier Part Number 1: 445-8644-1-ND
L7 L8 = NS00042: INDUCTOR COMMON MODE 90 OHM 25%; Part Number: NS00042; Type: Inductor; Value: 90R@100Mhz; ComponentLink1Description: Datasheet; ComponentLink1URL: H:\Doc\Bourns\SRF2012A.pdf; Supplier 1: Digi-Key; Supplier Part Number 1: SRF2012-900YATR-ND
L9 = NS00953: CMC 1A 2LN 600 OHM SMD; Type: Inductor; Part Number: NS00953; Value: 600R@100MHz, 1A; ComponentLink1Description: Datasheet; ComponentLink1URL: H:\Doc\pulse\datasheet_w719_1608373692.pdf; Supplier 1: Digi-Key; Supplier Part Number 1: 553-PE-1210CCMC601STSCT-ND
LS1 = CMP-231724-000001-1: AUDIO MAGNETIC INDICATOR 3-7V TH; Input Type: DC; Bandwidth: 2.3kHz; Nominal Supply Voltage (DC): 5V; Max Supply Current: 30mA; Washable: Yes; Max Supply Voltage (DC): 7V; Min Supply Voltage: 3V; Series: AI; Width: 12mm; REACH SVHC: No SVHC; Contact Plating: Tin; Frequency: 2.3kHz; Operating Supply Current: 30mA; Weight: 0.01lb; Current Rating: 30mA; Mount: Through Hole; Packaging: Tray; Length: 12mm; Lead Free: Lead Free; Color: Black; Input Current: 30mA; Min Operating Temperature: -40°C; Self Resonant Frequency: 2.3kHz; Sensing Method: Magnetic; Voltage Rating (DC): 5V; Height: 9.5mm; Termination: PC Pins; Min Supply Voltage (DC): 3V; Package Quantity: 100; Max Supply Voltage: 7V; Diameter: 12mm; Max Operating Temperature: 85°C; Supplier 1: Digi-Key; Supplier Part Number 1: 668-1019-ND
Q10 = CMP-1048-01467-1: Amplifier Transistor, NPN Silicon, 3-Pin TO-92, Bulk Box; Manufacturer: On Semiconductor; IC Continuous (A): 0.1; fT Min (MHz): 150; DatasheetVersion: Rev. 7; ComponentLink1URL: http://www.onsemi.com/; Polarity: NPN; RoHS: FALSE; ComponentLink1Description: Manufacturer URL; Packing: Bulk Box; PackageDescription: 3-Pin Transistor Outline, Body 4.825 x 3.685 mm, Pitch 1.27 mm; ComponentLink3URL: http://www.onsemi.cn/pub_link/Collateral/2N6426-D.PDF; ComponentLink2Description: Datasheet; PackageVersion: Rev. AM; PackageReference: TO-92-3-29-11_AM_SL; ComponentLink3Description: Package Specification; Mounting Technology: Through Hole; PartNumber: BC547B; ComponentLink2URL: http://www.onsemi.com/pub_link/Collateral/BC546-D.PDF; Supplier 1: Digi-Key; Supplier Part Number 1: BC547BFS-ND
R43 = NS00946: RES 2 OHM 1% 1/4W 1206; Alternatives: Generic; Part Number: NS00946; Type: R; Value: 2R, 1%, 1/4W; Supplier 1: Digi-Key; Supplier Part Number 1: 738-RMCF1206FT2R00CT-ND
R45 R80 R81 = NS00870: RES 100 OHM 1% 1/10W 0603; Alternatives: Generic; Part Number: NS00870; Type: R; Value: 100R, 1%, 1/10W; Supplier 1: Digi-Key; Supplier Part Number 1: RMCF0603FT100RCT-ND
R71 R83-R88 = NS00820: RES 10K OHM 1% 1/10W 0603; Alternatives: Generic; Part Number: NS00820; Type: R; Value: 10k, 1%, 1/10W; Supplier 1: Digi-Key; Supplier Part Number 1: RMCF0603FT10K0CT-ND
R74-R76 R82 R89-R91 = NS00876: RES 0 OHM JUMPER 1/10W 0603; Alternatives: Generic; Part Number: NS00876; Type: R; Value: 0R, 1/10W; Supplier 1: Digi-Key; Supplier Part Number 1: RMCF0603ZT0R00CT-ND
R118 R120 R122 R124 = NS00835: RES 100K OHM 1% 1/10W 0603; Alternatives: Generic; Part Number: NS00835; Type: R; Value: 100k, 1%, 1/10W; Supplier 1: Digi-Key; Supplier Part Number 1: RMCF0603FT100KCT-ND
R119 R121 R123 = NS00834: RES 15K OHM 1% 1/10W 0603; Alternatives: Generic; Part Number: NS00834; Type: R; Value: 15k, 1%, 1/10W; Supplier 1: Digi-Key; Supplier Part Number 1: 1292-WR06X1502FTLCT-ND
R125 = NS00823: RES 26.7K OHM 1% 1/10W 0603; Alternatives: Generic; Part Number: NS00823; Type: R; Value: 26.7k, 1%, 1/10W; Supplier 1: Digi-Key; Supplier Part Number 1: RMCF0603FT26K7
U11 = NS00919: IC VREF SERIES 0.1% SOT23-6; Part Number: NS00919; Type: IC; Value: MCP1501T-10E/CHY; ComponentLink1Description: Datasheet; ComponentLink1URL: H:\Doc\Microchip\20005474E-1.pdf; Supplier 1: Digi-Key; Supplier Part Number 1: MCP1501T-10E/CHYCT-ND
U12-U15 U19 = NS00913: TVS DIODE 5VWM 20VC 8-SOP; Part Number: NS00913; Type: IC; Value: STSP84050U800; ComponentLink1Description: Datasheet; ComponentLink1URL: H:\Doc\Eaton\eaton-stsp84xxxxxx-tvs-diode-array-esd-suppressor-data-sheet.pdf; Supplier 1: Digi-Key; Supplier Part Number 1: 283-STSP84050U800CT-ND

## Sheet Micro.SchDoc
size A3; SheetNumber: 5; SheetTotal: 9
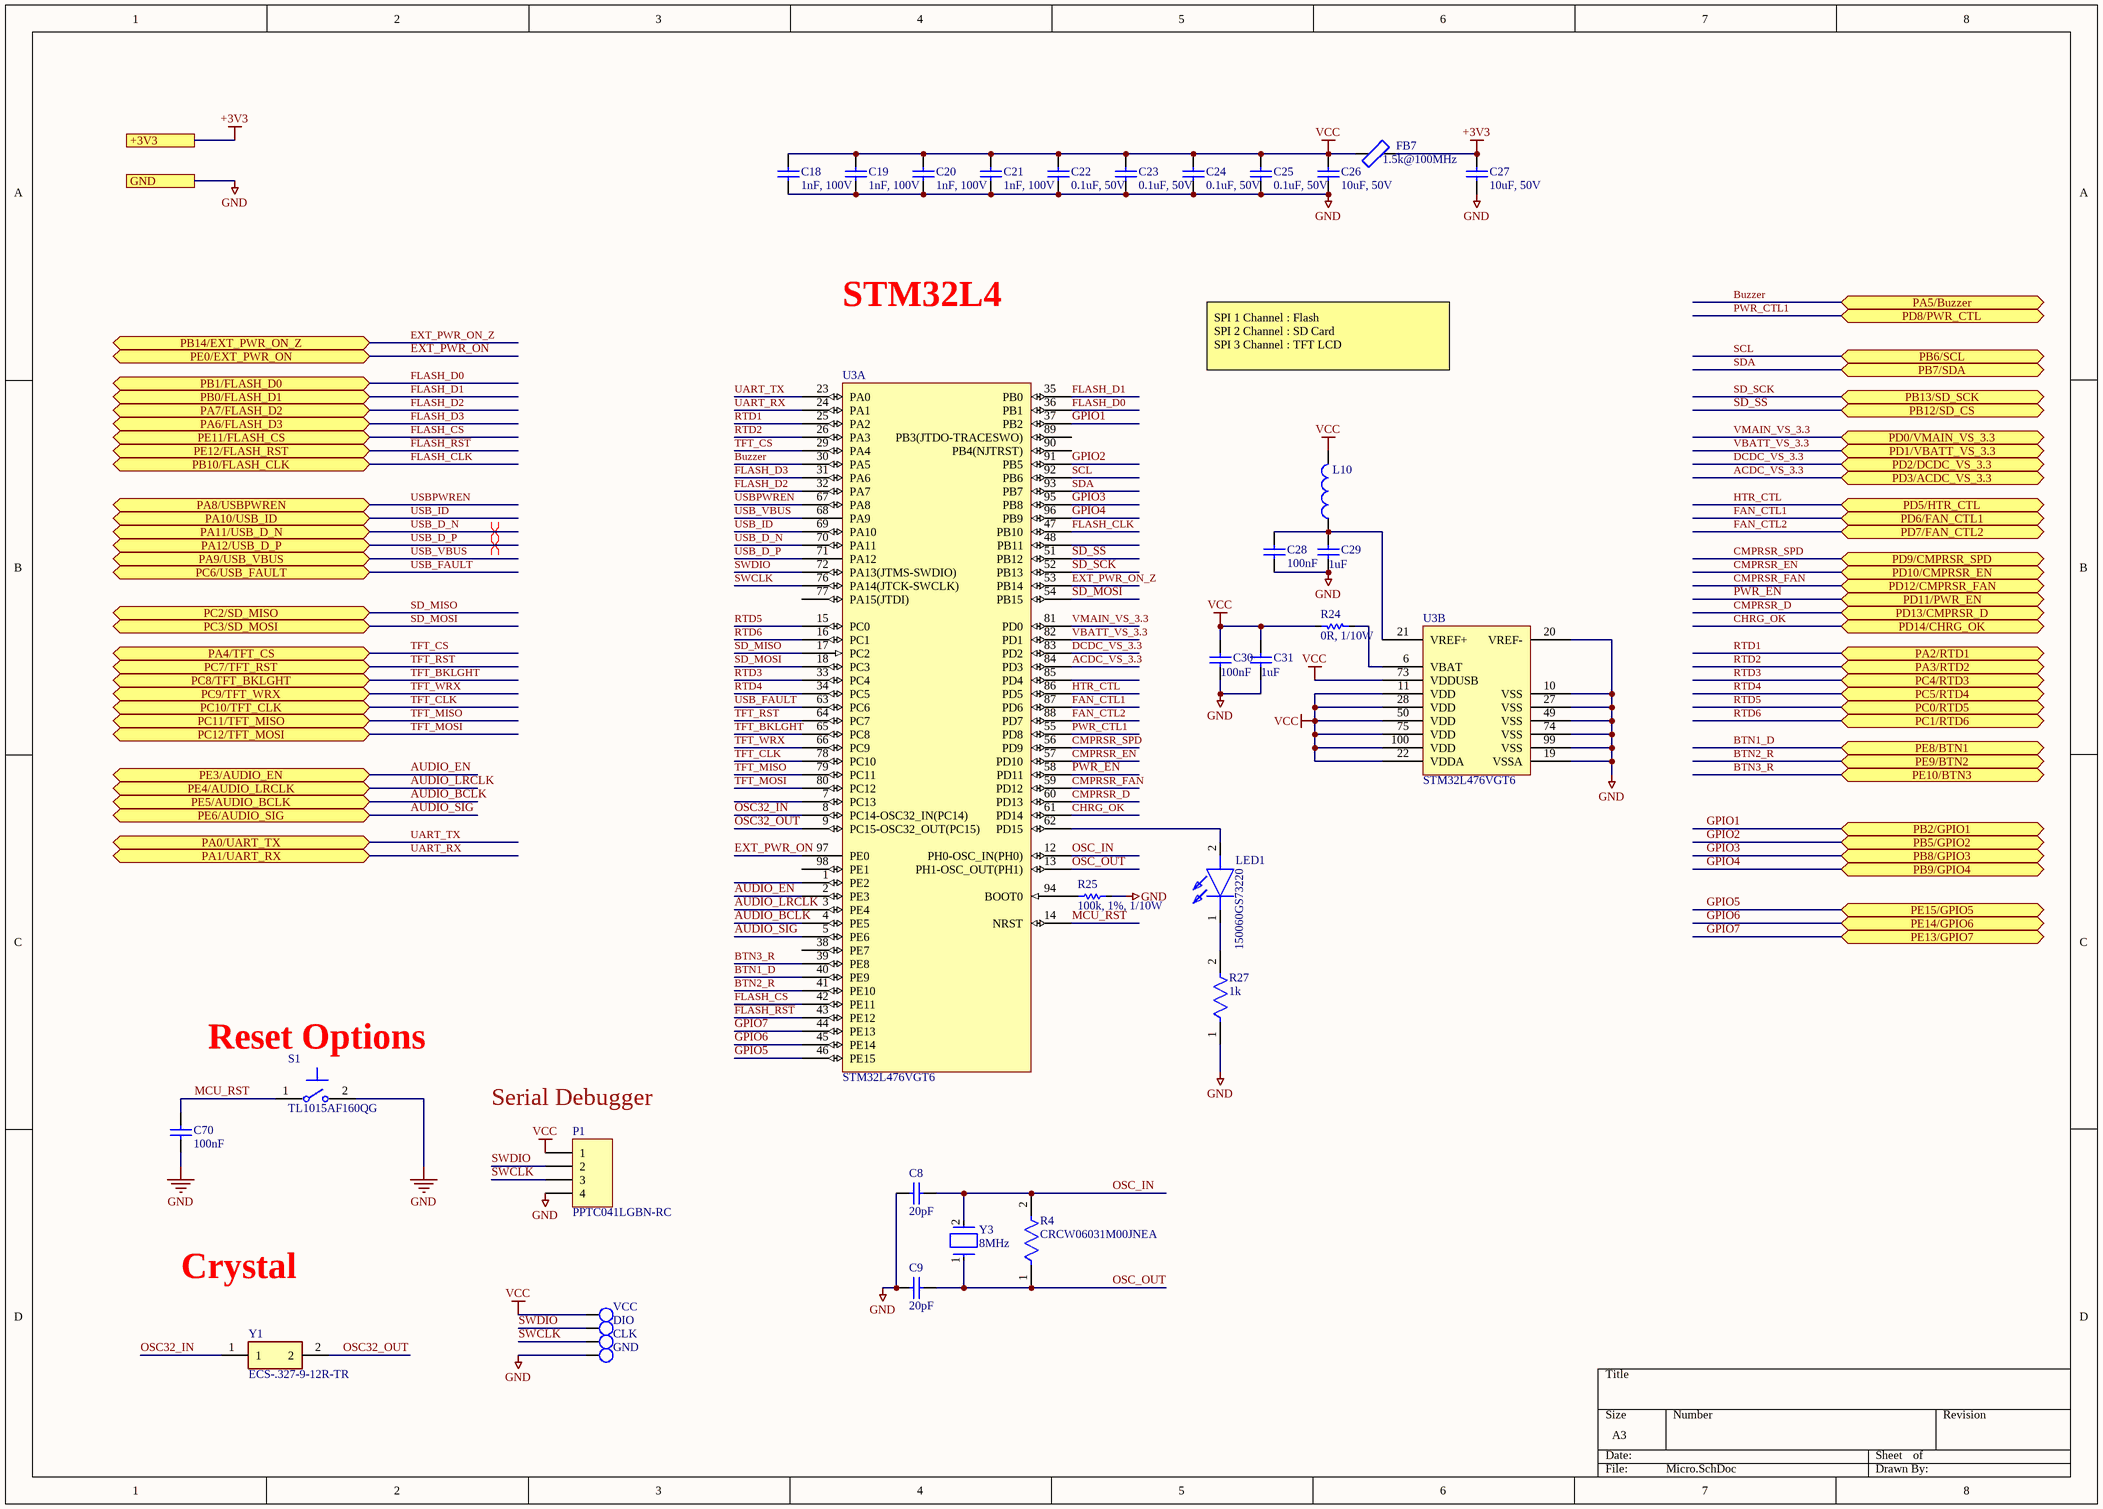
[diagram p2: Micro.SchDoc]

### Parts
C8  20pF  [CAPC1608X90X35ML10T15]
C9  20pF  [CAPC1608X90X35ML10T15]
C18  1nF, 100V  [0603]
C19  1nF, 100V  [0603]
C20  1nF, 100V  [0603]
C21  1nF, 100V  [0603]
C22  0.1uF, 50V  [0805]
C23  0.1uF, 50V  [0805]
C24  0.1uF, 50V  [0805]
C25  0.1uF, 50V  [0805]
C26  10uF, 50V  [1206]
C27  10uF, 50V  [1206]
C28  100nF  [CAPC1005X55X30LL05T10]
C29  value 1uF  [C1206]  (hidden comment: C1206C105K4RACTU)
C30  100nF  [CAPC1005X55X30LL05T10]
C31  value 1uF  [C1206]  (hidden comment: C1206C105K4RACTU)
C70  100nF  [CAPC1005X55X30LL05T10]
CLK  2mm  [TEST POINT 40 Mil]  (value not drawn)  (no BOM)
DIO  2mm  [TEST POINT 40 Mil]  (value not drawn)  (no BOM)
FB7  1.5k@100MHz  [0805]
GND  2mm  [TEST POINT 40 Mil]  (value not drawn)  (no BOM)
L10  BLM03AX121SN1D  [0603]  (value not drawn)
LED1  150060GS73220  [LED0603]
P1  PPTC041LGBN-RC  [HDR1X4]
R4  CRCW06031M00JNEA  [FP-CRCW0603-e3-IPC_B]
R24  0R, 1/10W  [0603]
R25  100k, 1%, 1/10W  [0603]
R27  1k  [FP-MCT0603-MFG]
S1  TL1015AF160QG  [FP-TL1015AF160QG-MFG]
U3  STM32L476VGT6  [STM-LQFP100_L]  (parts A,B of 2)
VCC  2mm  [TEST POINT 40 Mil]  (value not drawn)  (no BOM)
Y1  ECS-.327-9-12R-TR  [ABS0612732768KHZT]
Y3  8MHz  [FP-ABM3-MFG]

### Ports
+3V3, GND, PA0/UART_TX (bidir), PA1/UART_RX (bidir), PA2/RTD1 (bidir), PA3/RTD2 (bidir), PA4/TFT_CS (bidir), PA5/Buzzer (bidir), PA6/FLASH_D3 (bidir), PA7/FLASH_D2 (bidir), PA8/USBPWREN (bidir), PA9/USB_VBUS (bidir), PA10/USB_ID (bidir), PA11/USB_D_N (bidir), PA12/USB_D_P (bidir), PB0/FLASH_D1 (bidir), PB1/FLASH_D0 (bidir), PB2/GPIO1 (bidir), PB5/GPIO2 (bidir), PB6/SCL (bidir), PB7/SDA (bidir), PB8/GPIO3 (bidir), PB9/GPIO4 (bidir), PB10/FLASH_CLK (bidir), PB12/SD_CS (bidir), PB13/SD_SCK (bidir), PB14/EXT_PWR_ON_Z (bidir), PC0/RTD5 (bidir), PC1/RTD6 (bidir), PC2/SD_MISO (bidir), PC3/SD_MOSI (bidir), PC4/RTD3 (bidir), PC5/RTD4 (bidir), PC6/USB_FAULT (bidir), PC7/TFT_RST (bidir), PC8/TFT_BKLGHT (bidir), PC9/TFT_WRX (bidir), PC10/TFT_CLK (bidir), PC11/TFT_MISO (bidir), PC12/TFT_MOSI (bidir), PD0/VMAIN_VS_3.3 (bidir), PD1/VBATT_VS_3.3 (bidir), PD2/DCDC_VS_3.3 (bidir), PD3/ACDC_VS_3.3 (bidir), PD5/HTR_CTL (bidir), PD6/FAN_CTL1 (bidir), PD7/FAN_CTL2 (bidir), PD8/PWR_CTL (bidir), PD9/CMPRSR_SPD (bidir), PD10/CMPRSR_EN (bidir), PD11/PWR_EN (bidir), PD12/CMPRSR_FAN (bidir), PD13/CMPRSR_D (bidir), PD14/CHRG_OK (bidir), PE0/EXT_PWR_ON (bidir), PE3/AUDIO_EN (bidir), PE4/AUDIO_LRCLK (bidir), PE5/AUDIO_BCLK (bidir), PE6/AUDIO_SIG (bidir), PE8/BTN1 (bidir), PE9/BTN2 (bidir), PE10/BTN3 (bidir), PE11/FLASH_CS (bidir), PE12/FLASH_RST (bidir), PE13/GPIO7 (bidir), PE14/GPIO6 (bidir), PE15/GPIO5 (bidir)

### Nets
+3V3: C18.2 C19.2 C20.2 C21.2 C22.2 C23.2 C24.2 C25.2 C26.2 C27.2 C30.2 C31.2 FB7.1 FB7.2 L10.2 P1.1 R24.2 U3.11(VDD) U3.22(VDDA) U3.28(VDD) U3.50(VDD) U3.73(VDDUSB) U3.75(VDD) U3.100(VDD) VCC.1(TP) ; port +3V3  [also labelled VCC]  [project net +3.3V]
GND: C8.2 C9.2 C18.1 C19.1 C20.1 C21.1 C22.1 C23.1 C24.1 C25.1 C26.1 C27.1 C28.1 C29.1 C30.1 C31.1 C70.1 GND.1(TP) P1.4 R25.1 R27.1 S1.2 U3.10(VSS) U3.19(VSSA) U3.20(VREF-) U3.27(VSS) U3.49(VSS) U3.74(VSS) U3.99(VSS) ; port GND
USB_VBUS: U3.68(PA9) ; port PA9/USB_VBUS
~{FLASH_RST}: U3.43(PE12) ; port PE12/FLASH_RST
ACDC_VS_3.3: U3.84(PD3) ; port PD3/ACDC_VS_3.3
AUDIO_BCLK: U3.4(PE5) ; port PE5/AUDIO_BCLK
AUDIO_EN: U3.2(PE3) ; port PE3/AUDIO_EN
AUDIO_LRCLK: U3.3(PE4) ; port PE4/AUDIO_LRCLK
AUDIO_SIG: U3.5(PE6) ; port PE6/AUDIO_SIG  [project net AUDIO_IN]
BTN1_D: U3.40(PE9) ; port PE8/BTN1
BTN2_R: U3.41(PE10) ; port PE9/BTN2
BTN3_R: U3.39(PE8) ; port PE10/BTN3
Buzzer: U3.30(PA5) ; port PA5/Buzzer
CHRG_OK: U3.61(PD14) ; port PD14/CHRG_OK
CMPRSR_D: U3.60(PD13) ; port PD13/CMPRSR_D
CMPRSR_EN: U3.57(PD10) ; port PD10/CMPRSR_EN
CMPRSR_FAN: U3.59(PD12) ; port PD12/CMPRSR_FAN
CMPRSR_SPD: U3.56(PD9) ; port PD9/CMPRSR_SPD
DCDC_VS_3.3: U3.83(PD2) ; port PD2/DCDC_VS_3.3
EXT_PWR_ON: U3.97(PE0) ; port PE0/EXT_PWR_ON
EXT_PWR_ON_Z: U3.53(PB14) ; port PB14/EXT_PWR_ON_Z
FAN_CTL1: U3.87(PD6) ; port PD6/FAN_CTL1
FAN_CTL2: U3.88(PD7) ; port PD7/FAN_CTL2
FLASH_CLK: U3.47(PB10) ; port PB10/FLASH_CLK  [project net CLK]
FLASH_CS: U3.42(PE11) ; port PE11/FLASH_CS  [project net CS]
FLASH_D0: U3.36(PB1) ; port PB1/FLASH_D0  [project net DQ0]
FLASH_D1: U3.35(PB0) ; port PB0/FLASH_D1  [project net DQ1]
FLASH_D2: U3.32(PA7) ; port PA7/FLASH_D2
FLASH_D3: U3.31(PA6) ; port PA6/FLASH_D3  [project net DQ3/~{HOLD}]
GPIO1: U3.37(PB2) ; port PB2/GPIO1
GPIO2: U3.91(PB5) ; port PB5/GPIO2
GPIO3: U3.95(PB8) ; port PB8/GPIO3
GPIO4: U3.96(PB9) ; port PB9/GPIO4
GPIO5: U3.46(PE15) ; port PE15/GPIO5
GPIO6: U3.45(PE14) ; port PE14/GPIO6
GPIO7: U3.44(PE13) ; port PE13/GPIO7
HTR_CTL: U3.86(PD5) ; port PD5/HTR_CTL
MCU_RST: C70.2 S1.1 U3.14(NRST)
OSC32_IN: U3.8(PC14-OSC32_IN(PC14)) Y1.1
OSC32_OUT: U3.9(PC15-OSC32_OUT(PC15)) Y1.2
OSC_IN: C8.1 R4.2 U3.12(PH0-OSC_IN(PH0)) Y3.2
OSC_OUT: C9.1 R4.1 U3.13(PH1-OSC_OUT(PH1)) Y3.1
PWR_CTL1: U3.55(PD8) ; port PD8/PWR_CTL
PWR_EN: U3.58(PD11) ; port PD11/PWR_EN
RTD1: U3.25(PA2) ; port PA2/RTD1
RTD2: U3.26(PA3) ; port PA3/RTD2
RTD3: U3.33(PC4) ; port PC4/RTD3
RTD4: U3.34(PC5) ; port PC5/RTD4
RTD5: U3.15(PC0) ; port PC0/RTD5
RTD6: U3.16(PC1) ; port PC1/RTD6
SCL: U3.92(PB6) ; port PB6/SCL  [project net I2C1_SCL]
SD_MISO: U3.17(PC2) ; port PC2/SD_MISO
SD_MOSI: U3.18(PC3) U3.54(PB15) ; port PC3/SD_MOSI
SD_SCK: U3.52(PB13) ; port PB13/SD_SCK
SD_SS: U3.51(PB12) ; port PB12/SD_CS
SDA: U3.93(PB7) ; port PB7/SDA  [project net I2C1_SDA]
SWCLK: CLK.1(TP) P1.3 U3.76(PA14(JTCK-SWCLK))
SWDIO: DIO.1(TP) P1.2 U3.72(PA13(JTMS-SWDIO))
TFT_BKLGHT: U3.65(PC8) ; port PC8/TFT_BKLGHT  [project net BKLGHT_ON]
TFT_CLK: U3.78(PC10) ; port PC10/TFT_CLK
TFT_CS: U3.29(PA4) ; port PA4/TFT_CS  [project net DISPL_CS]
TFT_MISO: U3.79(PC11) ; port PC11/TFT_MISO
TFT_MOSI: U3.80(PC12) ; port PC12/TFT_MOSI
TFT_RST: U3.64(PC7) ; port PC7/TFT_RST  [project net RESET]
TFT_WRX: U3.66(PC9) ; port PC9/TFT_WRX
UART_RX: U3.24(PA1) ; port PA1/UART_RX
UART_TX: U3.23(PA0) ; port PA0/UART_TX
USB_D_N: U3.70(PA11) ; port PA11/USB_D_N
USB_D_P: U3.71(PA12) ; port PA12/USB_D_P
USB_FAULT: U3.63(PC6) ; port PC6/USB_FAULT  [project net OTG_FLT]
USB_ID: U3.69(PA10) ; port PA10/USB_ID
USBPWREN: U3.67(PA8) ; port PA8/USBPWREN  [project net OTG_PWR_EN]
VBATT_VS_3.3: U3.82(PD1) ; port PD1/VBATT_VS_3.3
VMAIN_VS_3.3: U3.81(PD0) ; port PD0/VMAIN_VS_3.3
NetC28_2: C28.2 C29.2 L10.1 U3.21(VREF+)
NetLED1_1: LED1.1(K) R27.2
NetLED1_2: LED1.2(A) U3.62(PD15)
NetR24_1: R24.1 U3.6(VBAT)
NetR25_2: R25.2 U3.94(BOOT0)

Not connected (* = marked no-connect by the designer): U3 1(PE2) 7(PC13) 38(PE7) 48(PB11) 77(PA15(JTDI)) 85(PD4) 89(PB3(JTDO-TRACESWO)) 90(PB4(NJTRST)) 98(PE1)

### Layout directives
differential pair: USB_D_N, USB_D_P

### Notes on the sheet
- STM32L4
- SPI 1 Channel : Flash
  SPI 2 Channel : SD Card
  SPI 3 Channel : TFT LCD
- (near S1) Reset Options
- (near P1) Serial Debugger
- Crystal

### Library data of the parts
C8 C9 = CMP-2006-02630-1: GRM1885C1H200JA01J; Manufacturer: Murata; Part Number: GRM1885C1H200JA01J
C18-C21 = NS00847: CAP CER 1000PF 100V C0G/NP0 0603; Type: C; Alternatives: Generic; Part Number: NS00847; Value: 1nF, 100V; Supplier 1: Digi-Key; Supplier Part Number 1: 732-12187-1-ND
C22-C25 = NS00353: 0.10µF ±10% 50V Ceramic Capacitor X7R 0805 (2012 Metric); Type: C; Alternatives: Generic; Part Number: NS00353; Value: 0.1uF, 50V; Supplier 1: Digi-Key; Supplier Part Number 1: 478-1395-1-ND
C26 C27 = NS00832: as C45 on sheet TopLevel; Part Number: NS00832; Value: 10uF, 50V; Supplier 1: Digi-Key; Supplier Part Number 1: 1276-6767-1-ND
C28 C30 C70 = CMP-0001-00074-2: Supplier 1: Digi-Key; Supplier Part Number 1: 399-C0402C104K4RAC7867TR-ND
C29 C31 = Cap Semi: Capacitor (Semiconductor SIM Model); Published: 8-Jun-2000; LatestRevisionDate: 29-May-2009; LatestRevisionNote: IPC-7351 Footprint Added.; PackageReference: C1206; Publisher: Altium Limited; PackageDescription: Chip Capacitor; Supplier 1: Digi-Key; Supplier Part Number 1: 399-C1206C105K4RAC7800TR-ND
CLK DIO GND VCC = NS00254: Testpoint 2mm round; Part Number: NS00254; Type: Mechanical; Value: 2mm
FB7 = NS00881: WE-CBA SMT EMI SUPPRESSION FERRITE; Type: Inductor; Part Number: NS00881; Value: 1.5k@100MHz; ComponentLink1Description: Datasheet; ComponentLink1URL: H:\Doc\Wurth\782853162.pdf; Supplier 1: Digi-Key; Supplier Part Number 1: 732-782853162CT-ND
L10 = Inductor: Code_IEC: 1005; Published: 8-Jun-2000; LatestRevisionDate: 29-May-2009; LatestRevisionNote: IPC-7351 Footprint Added.; PackageReference: 0402-A; Publisher: Altium Limited; PackageDescription: Chip Inductor; Code_JEITA: 0402; Value: BLM03AX121SN1D; Supplier 1: Digi-Key; Supplier Part Number 1: 490-5622-2-ND
LED1 = 150060GS73220: LED; Manufacturer_Name: Wurth Elektronik; Datasheet Link: https://katalog.we-online.de/led/datasheet/150060GS73220.pdf; Height: 0.3mm; Manufacturer_Part_Number: 150060GS73220; Mouser Part Number: 710-150060GS73220; Mouser Price/Stock: https://www.mouser.com/Search/Refine.aspx?Keyword=710-150060GS73220; RS Part Number: 1766086; RS Price/Stock: https://uk.rs-online.com/web/p/products/1766086; Supplier 1: Digi-Key; Supplier Part Number 1: 732-11995-2-ND
P1 = Header 4: Header, 4-Pin; LatestRevisionDate: 17-Jul-2002; LatestRevisionNote: Re-released for DXP Platform.; Publisher: Altium Limited; Supplier 1: Digi-Key; Supplier Part Number 1: SAM1112-04-ND
R4 = CMP-2000-03016-2: RES Thick Film, 1MΩ, 5%, 0.1W, 200ppm/°C, 0603; Max Power Dissipation: 100mW; Resistance: 1MR; Voltage Rating: 75V; Temperature Coefficient: 200ppm/°C; Military Standard: Not; Mount: Surface Mount; Package Quantity: 1; Number of Pins: 2; Power Rating: 100mW; Packaging: Tape and Reel; Length: 1.55mm; Width: 0.85mm; Height: 0.02inch; Min Operating Temperature: -55°C; Tolerance: 5%; Depth: 0.85mm; Composition: Thick Film; Number of Terminations: 2; Max Operating Temperature: 155°C; Termination: SMD/SMT; Case Code (Imperial): 0603; Weight: 7.1E-05oz; Case Code (Metric): 1608; Radiation Hardening: No; Contact Plating: Tin; Case/Package: 0603; Features: Automotive AEC-Q200
R24 = NS00876: as R74 on sheet TopLevel; Part Number: NS00876; Type: R; Value: 0R, 1/10W; Supplier 1: Digi-Key; Supplier Part Number 1: RMCF0603ZT0R00CT-ND
R25 = NS00835: as R118 on sheet TopLevel; Part Number: NS00835; Type: R; Value: 100k, 1%, 1/10W; Supplier 1: Digi-Key; Supplier Part Number 1: RMCF0603FT100KCT-ND; Parameter 1: *
R27 = CMP-02407-007689-1: RES SMD 1 kOHM 1% 1/8W 0603; Power Rating: 125mW; Voltage Rating: 75V; Resistance: 150R; Temperature Coefficient: 25ppm/°C; Tolerance: 0.1%; Length: 0.061inch; Composition: Thin Film; Weight: 7.1E-05oz; Case Code (Imperial): 0603; Voltage Rating (DC): 75V; Termination: SMD/SMT; Max Power Dissipation: 125mW; Case Code (Metric): 1608; Package Quantity: 1; Height: 0.45mm; Radiation Hardening: No; Width: 0.033inch; Max Operating Temperature: 155°C; Case/Package: 0603; Features: Automotive AEC-Q200; Contact Plating: Tin; Packaging: Tape and Reel; Number of Pins: 2; Number of Terminations: 2; REACH SVHC: No SVHC; Depth: 0.85mm; Min Operating Temperature: -55°C; Supplier 1: Digi-Key; Supplier Part Number 1: 311-1.0KGRTR-ND
S1 = CMP-17879-000003-1: SWITCH TACTILE SPST-NO 0.05A 12V; Actuator Type: Standard; Actuator Length: 0.5mm; Contact Current Rating: 50mA; Mechanical Life: 200000Cycles; Switch Function: Off-Mom; Switch Travel: 0.2mm; Illumination Type: Non-Illuminated; Operating Force: 160gf; Actuator Material: Nylon; Electrical Life: 50000Cycles; Throw Configuration: SPST; Contact Resistance: 100mR; Orientation: Straight; Max Voltage Rating (DC): 12V; Max Operating Temperature: 70°C; Package Quantity: 1; Contact Material: Silver; Packaging: Tape and Reel; Mount: Surface Mount; Color: Beige; Termination: Gull Wing; Case/Package: SMD/SMT; Voltage Rating (DC): 12V; Contact Plating: Silver; REACH SVHC: No SVHC; Min Operating Temperature: -20°C; Current Rating: 50mA; Lead Free: Lead Free; Supplier 1: Digi-Key; Supplier Part Number 1: EG4344TR-ND
U3 = CMP-1655-00015-2: Ultra-Low-Power ARM Cortex-M4 32-bit MCU+FPU, 1024 KB Flash, 128 KB Internal RAM, 82 I/Os, 100-Pin LQFP, -40 to 85 degC, Tray; Manufacturer: STMicroelectronics; I/Os (High Current): 82; Supply Voltage(Vcc) min (V): 1.71; Internal RAM Size (kB): 128; D/A Converter: 2; Operating Frequency(F) (Processor speed) (MHz): 80; FLASH Size (Prog) (kB): 1024; Packing: Tray; Package Description: 100-Pin Low Profile Quad Flat Package, Body 14 x 14 mm, Pitch 0.5 mm; Package Reference: LQFP100; ComponentLink1URL: http://www.st.com/; DatasheetVersion: Rev. 4; PartNumber: STM32L476VGT6; Core: ARM Cortex-M4; Mounting Technology: Surface Mount; ComponentLink1Description: Manufacturer URL; ComponentLink2URL: http://www.st.com/st-web-ui/static/active/en/resource/technical/document/datasheet/DM00108832.pdf; ComponentLink2Description: Datasheet; Supplier 1: Digi-Key; Supplier Part Number 1: 497-15873-ND
Y1 = ABS07W-32.768KHZ-J-1-T: Crystal or Oscillator; Manufacturer_Name: ABRACON; Datasheet Link: https://abracon.com/iotoptimized_quartzcrystals/assets/ABS07W.pdf; Manufacturer_Part_Number: ABS07W-32.768KHZ-J-1-T; Mouser Part Number: 815-ABS07W32.768KJ1T; Mouser Price/Stock: https://www.mouser.com/Search/Refine.aspx?Keyword=815-ABS07W32.768KJ1T; RS Part Number: 1710341P; RS Price/Stock: http://uk.rs-online.com/web/p/products/1710341P; Supplier 1: Digi-Key; Supplier Part Number 1: XC2745TR-ND
Y3 = CMP-2000-05033-2: Crystal 8MHz ±20ppm 18pF SMD-2 5mm x 3.2mm; Series Resistance: 500R; Frequency Stability: 30ppm; ESR (Equivalent Series Resistance): 140R; Load Capacitance: 18pF; Height: 0.051inch; Tolerance: 20ppm; Depth: 3.2mm; Max Operating Temperature: 85°C; Frequency: 8MHz; Termination: SMD/SMT; Lead Free: Lead Free; Number of Pins: 2; Width: 3.2mm; RoHS Compliant: Yes; Resistor Type: Ceramic; Length: 5mm; Mount: Surface Mount; Case/Package: CSMD; Package Quantity: 1000; Radiation Hardening: No; Min Operating Temperature: -40°C; Packaging: Tape and Reel; Frequency Tolerance: 20ppm; Supplier 1: Digi-Key; Supplier Part Number 1: ABM3-8.000MHZ-D2Y-T